# Altium schematic sheet JTAG.SchDoc: CONTROLADORA MAIS PIPOCA - REVISÃO EMC
size A3; DocumentNumber: 13; SheetNumber: 13; SheetTotal: 17
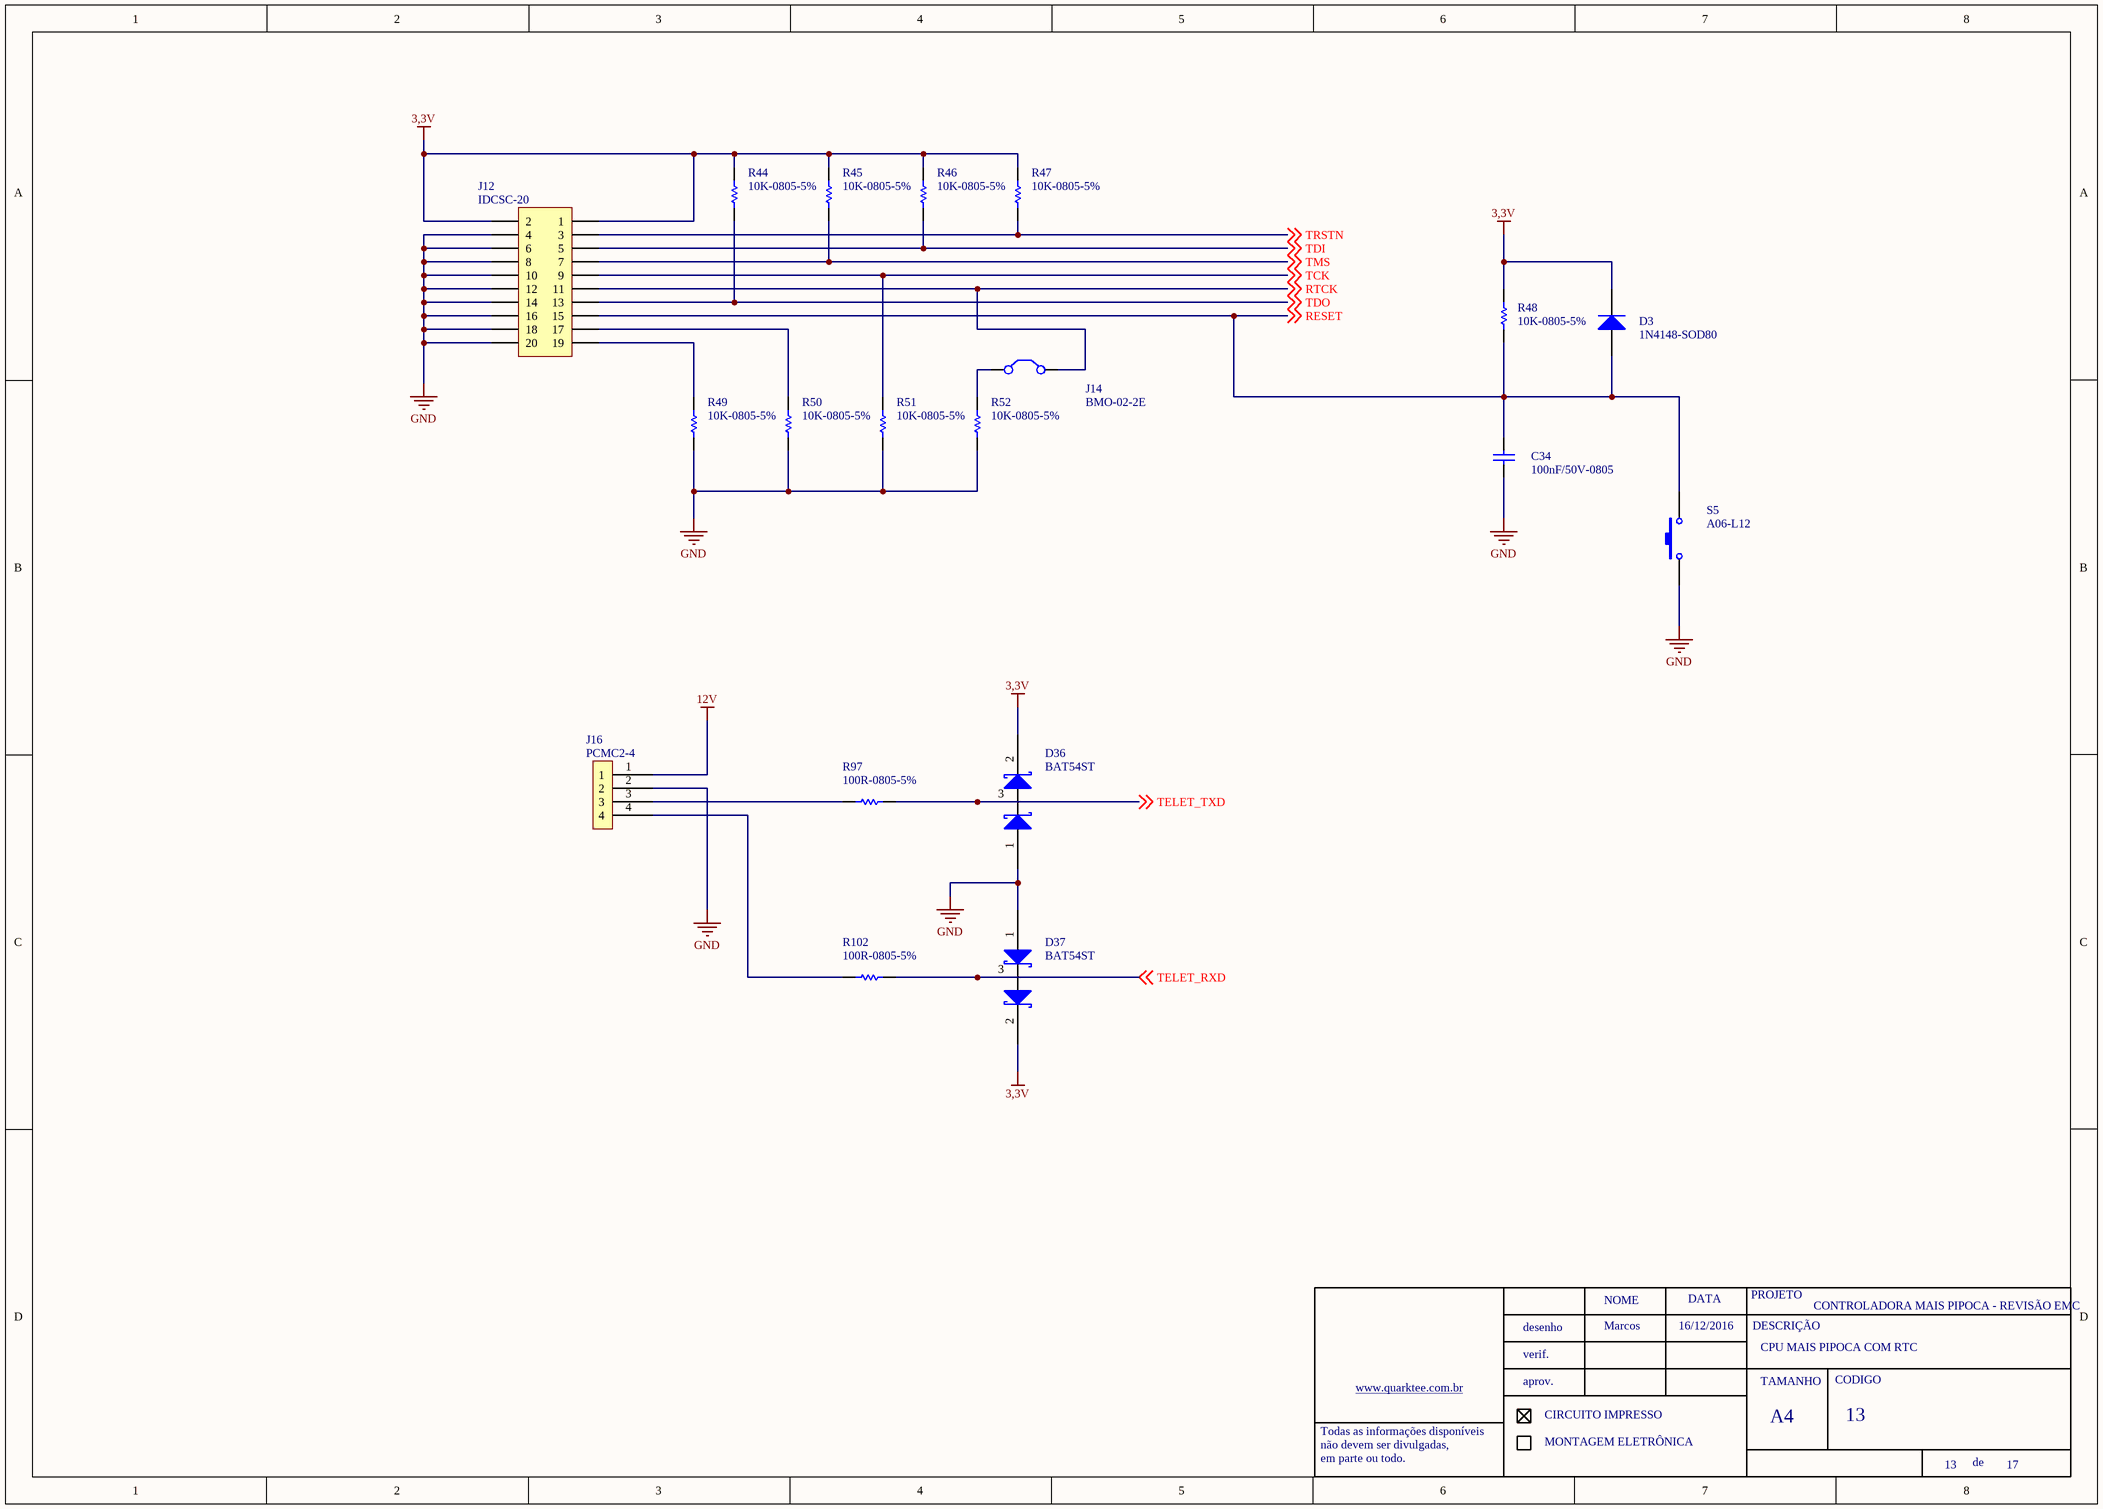
[diagram p0: JTAG.SchDoc]

## Parts
C34  100nF/50V-0805  [0805-REVISADO ONDA]
D3  1N4148-SOD80  [MINIMLEF/SOD80 - REVISADO ONDA]
D36  BAT54ST  [SOT23 - REVISADO ONDA]
D37  BAT54ST  [SOT23 - REVISADO ONDA]
J12  IDCSC-20  [IDCSC-20]
J14  BMO-02-2E  [JUMPER100]
J16  PCMC2-4  [PHMC4-04]
R44  10K-0805-5%  [0805-REVISADO ONDA]
R45  10K-0805-5%  [0805-REVISADO ONDA]
R46  10K-0805-5%  [0805-REVISADO ONDA]
R47  10K-0805-5%  [0805-REVISADO ONDA]
R48  10K-0805-5%  [0805-REVISADO ONDA]
R49  10K-0805-5%  [0805-REVISADO ONDA]
R50  10K-0805-5%  [0805-REVISADO ONDA]
R51  10K-0805-5%  [0805-REVISADO ONDA]
R52  10K-0805-5%  [0805-REVISADO ONDA]
R97  100R-0805-5%  [0805-REVISADO ONDA]
R102  100R-0805-5%  [0805-REVISADO ONDA]
S5  A06-L12  [CHAVE_A06]

## Nets
3,3V: D3.2 D36.2 D37.2 J12.1 J12.2 R44.1 R45.1 R46.1 R47.1 R48.2
12V: J16.1
GND: C34.1 D36.1 D37.1 J12.4 J12.6 J12.8 J12.10 J12.12 J12.14 J12.16 J12.18 J12.20 J16.2 R49.2 R50.2 R51.2 R52.2 S5.1
RESET: C34.2 D3.1 J12.15 R48.1 S5.2 ; off-sheet RESET
RTCK: J12.11 J14.2(C2) ; off-sheet RTCK
TCK: J12.9 R51.1 ; off-sheet TCK
TDI: J12.5 R46.2 ; off-sheet TDI
TDO: J12.13 R44.2 ; off-sheet TDO
TELET_RXD: D37.3 R102.2 ; off-sheet TELET_RXD
TELET_TXD: D36.3 R97.2 ; off-sheet TELET_TXD
TMS: J12.7 R45.2 ; off-sheet TMS
TRSTN: J12.3 R47.2 ; off-sheet TRSTN
NetJ12_17: J12.17 R50.1
NetJ12_19: J12.19 R49.1
NetJ14_1: J14.1(C1) R52.1
NetJ16_3: J16.3 R97.1
NetJ16_4: J16.4 R102.1

## Notes on the sheet
- Marcos
- 16/12/2016
- CPU MAIS PIPOCA COM RTC
- NOME
- DATA
- PROJETO
- DESCRIÇÃO
- www.quarktee.com.br
- desenho
- verif.
- aprov.
- TAMANHO
- CODIGO
- Todas as informações disponíveis
- não devem ser divulgadas,
- em parte ou todo.
- CIRCUITO IMPRESSO
- MONTAGEM ELETRÔNICA
- A4
- de

## Library data of the parts
C34 = 100nF/50-0805-NPO: ERP: 104.11.005
J12 = HEADER 10x2: BARRA DE PINOS 10x2 VIAS; ERP: 10 x 434.00.060
J14 = BARRA DE PINOS: ERP: 434.00.060
R44-R47 R49-R52 = RES 10K-0805: ERP: 103.03.054
D3 = 1N4148-SOD80: ERP: 120.19.001
R48 = 10K-0805-5%: ERP: 102.11.054
R97 R102 = 100R-0805-5%: ERP: 102.11.031
S5 = A06-L12: ERP: 136.00.001